# EAGLE design Control Board v0.2 (EAGLE 7.7.0)
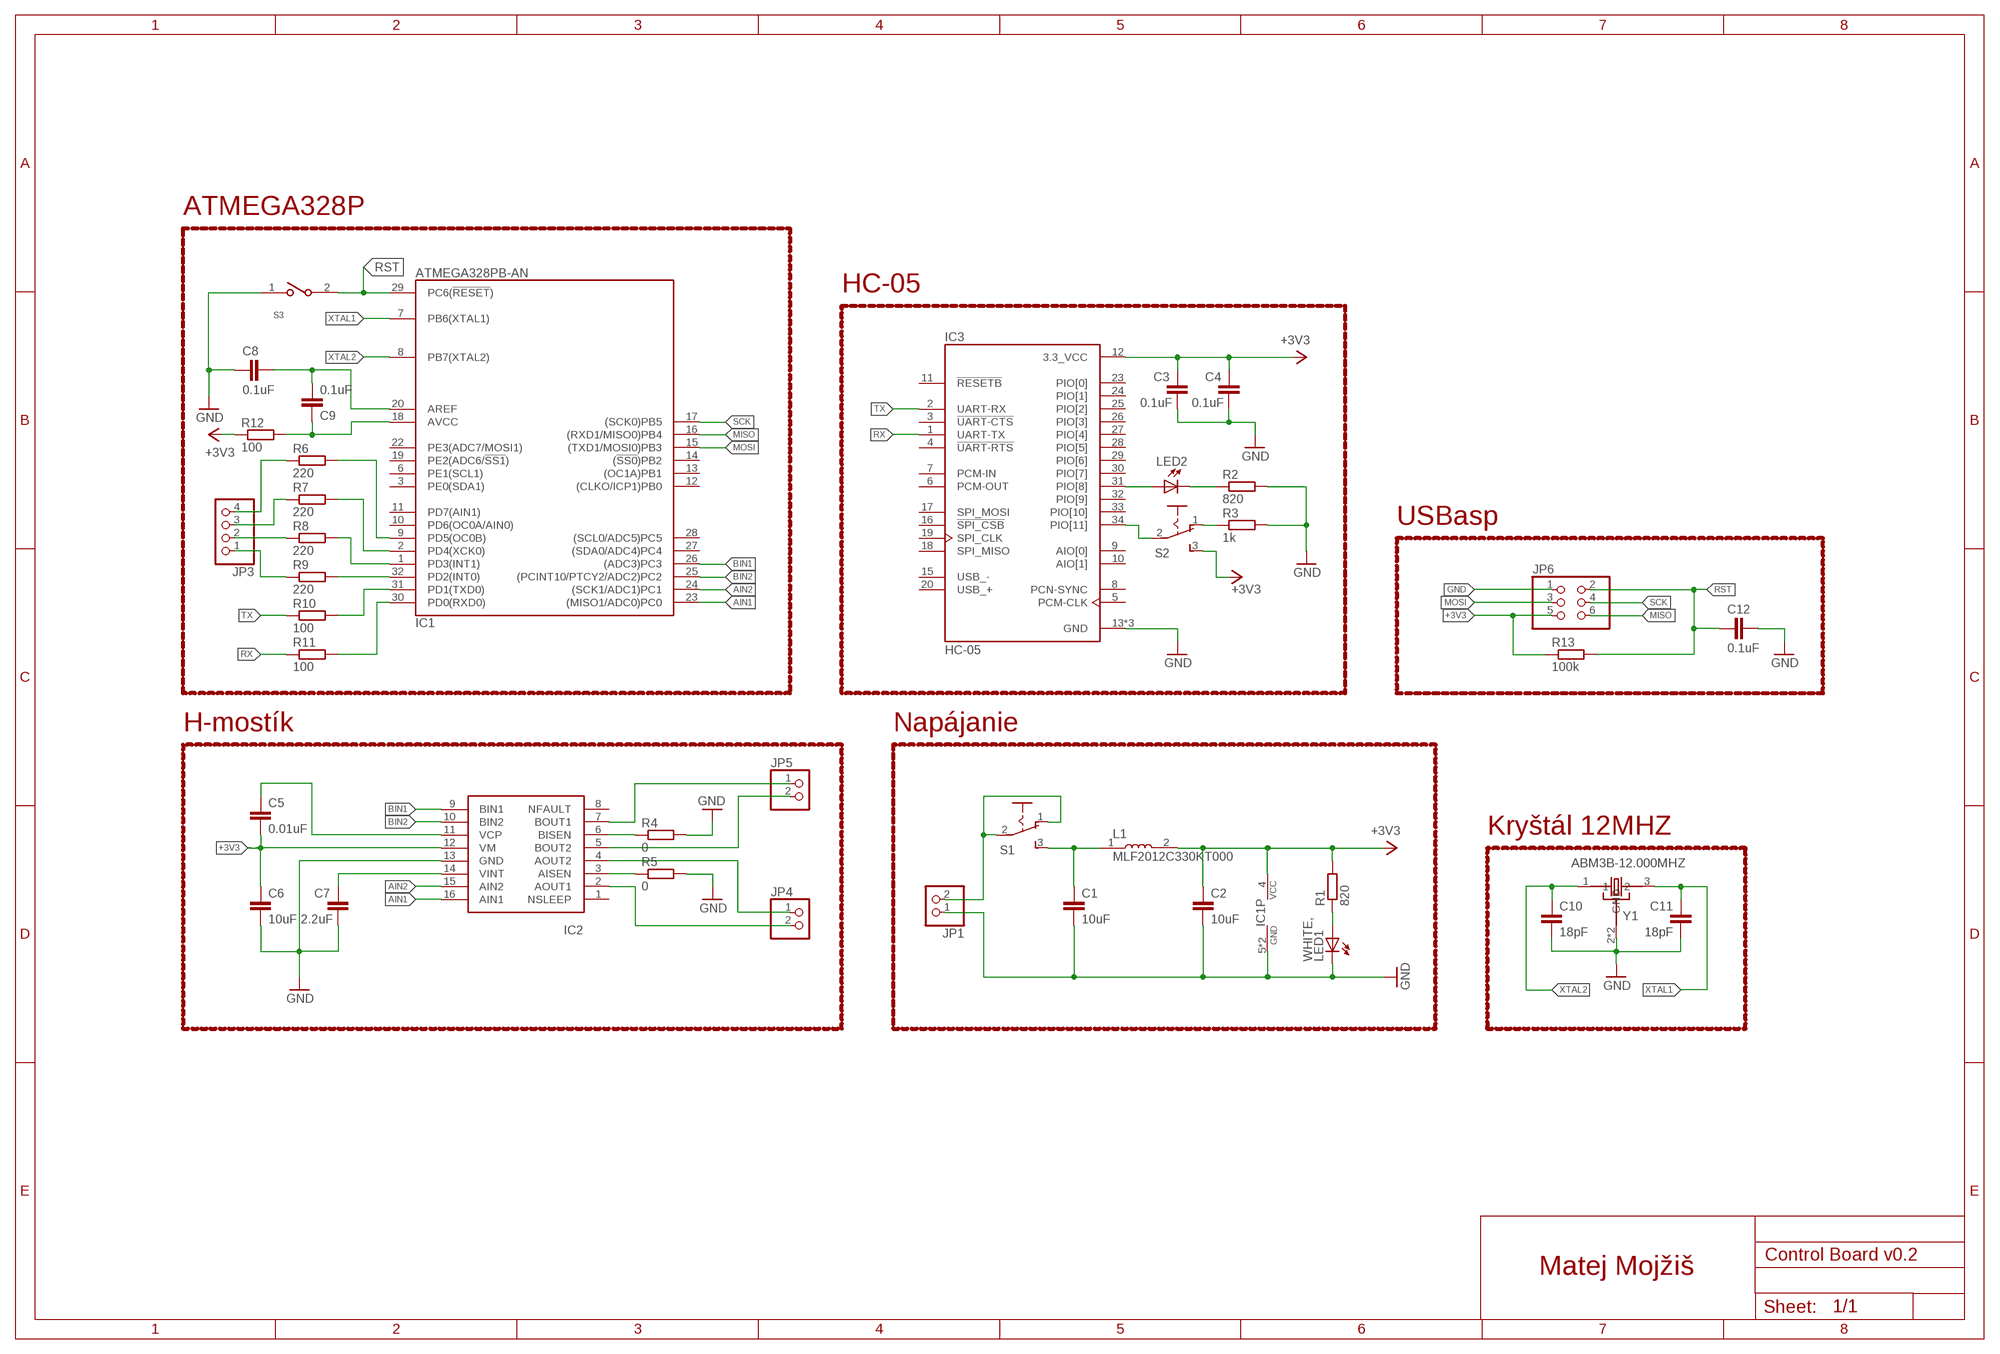
[diagram p0: schematic, sheet 1]

## Parts
C1  10uF  C-EUC0805  [C0805]
C2  10uF  C-EUC0805  [C0805]
C3  0.1uF  C-EUC0805  [C0805]
C4  0.1uF  C-EUC0805  [C0805]
C5  0.01uF  C-EUC0805  [C0805]
C6  10uF  C-EUC0805  [C0805]
C7  2.2uF  C-EUC0805  [C0805]
C8  0.1uF  C-EUC0805  [C0805]
C9  0.1uF  C-EUC0805  [C0805]
C10  18pF  C-EUC0805  [C0805]
C11  18pF  C-EUC0805  [C0805]
C12  0.1uF  C-EUC0805  [C0805]
IC1  ATMEGA328PB-AN  [QFP32_7X7_0.80]
IC2  DVR8833SUPERFICIAL  [PWP16]
IC3  HC-05  [XCVR_HC-05]
JP1  PINHD-1X2/90  [1X02/90]
JP3  PINHD-1X4  [1X04]
JP4  PINHD-1X2/90  [1X02/90]
JP5  PINHD-1X2/90  [1X02/90]
JP6  PINHD-2X3  [2X03]
L1  MLF2012C330KT000  [INDC2012X87N]
LED1  WHITE,  LEDCHIPLED_0805  [CHIPLED_0805]
LED2  RED  LEDCHIPLED_0805  [CHIPLED_0805]
R1  820  R-EU_R0805  [R0805]
R2  820  R-EU_R0805  [R0805]
R3  1k  R-EU_R0805  [R0805]
R4  0  R-EU_R0805  [R0805]
R5  0  R-EU_R0805  [R0805]
R6  220  R-EU_R0805  [R0805]
R7  220  R-EU_R0805  [R0805]
R8  220  R-EU_R0805  [R0805]
R9  220  R-EU_R0805  [R0805]
R10  100  R-EU_R0805  [R0805]
R11  100  R-EU_R0805  [R0805]
R12  100  R-EU_R0805  [R0805]
R13  100k  R-EU_R0805  [R0805]
S1  255SB  [255SB]
S2  255SB  [255SB]
S3  147873-2  [SW_147873-2]
Y1  ABM3B-12.000MHZ  ABM3B-8.000MHZ-B2-T  [OSCSC500X320X110-4N]

## Nets
3V7: C1.1 L1.1 S1.3(S)
+3V3: C2.1 C3.1 C4.1 C5.2 C6.1 IC1.4(VCC) IC2.12(VM) IC3.12(3.3_VCC) JP6.5 L1.2 R1.2 R12.1 R13.1 S2.3(S)
+3V7: JP1.2 S1.1(O) S1.2(P)
AIN1: IC1.23((MISO1/ADC0)PC0) IC2.16(AIN1)
AIN2: IC1.24((SCK1/ADC1)PC1) IC2.15(AIN2)
AISEN: IC2.3(AISEN) R5.1
AOUT1: IC2.2(AOUT1) JP4.2
AOUT2: IC2.4(AOUT2) JP4.1
AREF: C8.1 C9.2 IC1.20(AREF)
AVCC: C9.1 IC1.18(AVCC) R12.2
BACK: JP3.2 R8.1
BIN1: IC1.26((ADC3)PC3) IC2.9(BIN1)
BIN2: IC1.25((PCINT10/PTCY2/ADC2)PC2) IC2.10(BIN2)
BISEN: IC2.6(BISEN) R4.1
BOUT1: IC2.7(BOUT1) JP5.1
BOUT2: IC2.5(BOUT2) JP5.2
FRONT: JP3.1 R9.1
GND: C1.2 C2.2 C3.2 C4.2 C6.2 C7.2 C8.2 C10.2 C11.2 C12.1 IC1.5(GND) IC1.21(GND) IC2.13(GND) IC3.13(GND) IC3.21(GND) IC3.22(GND) JP1.1 JP6.1 LED1.C R2.2 R3.2 R4.2 R5.2 S3.1 Y1.2(GND) Y1.4(GND)
IN: LED1.A R1.1
INRX: IC1.30(PD0(RXD0)) R11.2
LED: LED2.C R2.1
LEFT: JP3.3 R7.1
MISO: IC1.16((RXD1/MISO0)PB4) JP6.6
MOSI: IC1.15((TXD1/MOSI0)PB3) JP6.3
OUTTX: IC1.31(PD1(TXD0)) R10.2
PD2: IC1.32(PD2(INT0)) R9.2
PD3: IC1.1(PD3(INT1)) R8.2
PD4: IC1.2(PD4(XCK0)) R7.2
PD5: IC1.9(PD5(OC0B)) R6.2
PIO8: IC3.31(PIO[8]) LED2.A
PIO11: IC3.34(PIO[11]) S2.2(P)
RIGHT: JP3.4 R6.1
RST: C12.2 IC1.29(PC6(!RESET!)) JP6.2 R13.2 S3.2
RX: IC3.1(UART-TX) R11.1
S: R3.1 S2.1(O)
SCK: IC1.17((SCK0)PB5) JP6.4
TX: IC3.2(UART-RX) R10.1
VCP: C5.1 IC2.11(VCP)
VINT: C7.1 IC2.14(VINT)
XTAL1: C11.1 IC1.7(PB6(XTAL1)) Y1.3
XTAL2: C10.1 IC1.8(PB7(XTAL2)) Y1.1
Unconnected: IC1.3(PE0(SDA1)) IC1.6(PE1(SCL1)) IC1.10(PD6(OC0A/AIN0)) IC1.11(PD7(AIN1)) IC1.12((CLKO/ICP1)PB0) IC1.13((OC1A)PB1) IC1.14((!SS0!)PB2) IC1.19(PE2(ADC6/!SS1!)) IC1.22(PE3(ADC7/MOSI1)) IC1.27((SDA0/ADC4)PC4) IC1.28((SCL0/ADC5)PC5) IC2.1(NSLEEP) IC2.8(NFAULT) IC3.3(!UART-CTS) IC3.4(!UART-RTS) IC3.5(PCM-CLK) IC3.6(PCM-OUT) IC3.7(PCM-IN) IC3.8(PCN-SYNC) IC3.9(AIO[0]) IC3.10(AIO[1]) IC3.11(!RESETB) IC3.15(USB_-) IC3.16(!SPI_CSB) IC3.17(SPI_MOSI) IC3.18(SPI_MISO) IC3.19(SPI_CLK) IC3.20(USB_+) IC3.23(PIO[0]) IC3.24(PIO[1]) IC3.25(PIO[2]) IC3.26(PIO[3]) IC3.27(PIO[4]) IC3.28(PIO[5]) IC3.29(PIO[6]) IC3.30(PIO[7]) IC3.32(PIO[9]) IC3.33(PIO[10])

## Notes on the sheet
- ATMEGA328P
- HC-05
- USBasp
- H-mostík | Napájanie
- Kryštál 12MHZ
- Matej Mojžiš

## Library data of the parts
C1-C12 = rcl:C-EU: CAPACITOR, European symbol
IC1 = atmel328new:ATMEGA328PB: 8-bit AVR Microcontroller 32kbytes flash 2kbytes SRAM 1kbyte EEPROM USART 8-channel 10 bit ADC
IC2 = personales:DVR8833
IC3 = HC-05:HC-05: Bluetooth to Serial Port Module; AVAILABILITY: Unavailable; DESCRIPTION: Bluetooth to Serial Port Module; MF: Bel Power solution; MP: HC-05; PACKAGE: SOIC-14; PRICE: None
JP1 JP4 JP5 = pinhead:PINHD-1X2: PIN HEADER
JP3 = pinhead:PINHD-1X4: PIN HEADER
JP6 = pinhead:PINHD-2X3: PIN HEADER
L1 = MLF2012C330KT000:MLF2012C330KT000: FIXED IND 33UH 5MA 1.1 OHM SMD Check prices <https://pricing.snapeda.com/parts/MLF2012C330KT000/TDK/view-part?ref=eda>; AVAILABILITY: Warning; DESCRIPTION: Fixed Ind 33uh 5ma 1.1 Ohm Smd; MF: TDK; MP: MLF2012C330KT000; PACKAGE: 0805 TDK; PRICE: None; PURCHASE-URL: https://pricing.snapeda.com/search/part/MLF2012C330KT000/?ref=eda
LED1 LED2 = led:LED: LED OSRAM: - CHIPLED LG R971, LG N971, LY N971, LG Q971, LY Q971, LO R971, LY R971 LH N974, LH R974 LS Q976, LO Q976, LY Q976 LO Q996 - Hyper CHIPLED LW Q18S LB Q993, LB Q99A, LB R99A - SideLED LS A670, LO A670, LY A670, LG A670, LP A670 LB A673, LV A673, LT A673, LW A673 LH A674 LY A675 LS A676, LA A676, LO A676, LY A676, LW A676 LS A679, LY A679, LG A679 - Hyper Micro SIDELED® LS Y876, LA Y876, LO Y876, LY Y876 LT Y87S - SmartLED LW L88C, LW L88S LB L89C, LB L89S, LG L890 LS L89K, LO L89K, LY L89K LS L896, LA L896, LO L896, LY L896 - TOPLED LS T670, LO T670, LY T670, LG T670, LP T670 LSG T670, LSP T670, LSY T670, LOP T670, LYG T670 LG T671, LOG T671, LSG T671 LB T673, LV T673, LT T673, LW T673 LH T674 LS T676, LA T676, LO T676, LY T676, LB T676, LH T676, LSB T676, LW T676 LB T67C, LV T67C, LT T67C, LS T67K, LO T67K, LY T67K, LW E67C LS E67B, LA E67B, LO E67B, LY E67B, LB E67C, LV E67C, LT E67C LW T67C LS T679, LY T679, LG T679 LS T770, LO T770, LY T770, LG T770, LP T770 LB T773, LV T773, LT T773, LW T773 LH T774 LS E675, LA E675, LY E675, LS T675 LS T776, LA T776, LO T776, LY T776, LB T776 LHGB T686 LT T68C, LB T68C - Hyper Mini TOPLED® LB M676 - Mini TOPLED Santana® LG M470 LS M47K, LO M47K, LY M47K Source: http://www.osram.convergy.de LUXEON: - LUMILED® LXK2-PW12-R00, LXK2-PW12-S00, LXK2-PW14-U00, LXK2-PW14-V00 LXK2-PM12-R00, LXK2-PM12-S00, LXK2-PM14-U00 LXK2-PE12-Q00, LXK2-PE12-R00, LXK2-PE12-S00, LXK2-PE14-T00, LXK2-PE14-U00 LXK2-PB12-K00, LXK2-PB12-L00, LXK2-PB12-M00, LXK2-PB14-N00, LXK2-PB14-P00, LXK2-PB14-Q00 LXK2-PR12-L00, LXK2-PR12-M00, LXK2-PR14-Q00, LXK2-PR14-R00 LXK2-PD12-Q00, LXK2-PD12-R00, LXK2-PD12-S00 LXK2-PH12-R00, LXK2-PH12-S00 LXK2-PL12-P00, LXK2-PL12-Q00, LXK2-PL12-R00 Source: www.luxeon.com KINGBRIGHT: KA-3528ASYC Source: www.kingbright.com
R1-R13 = rcl:R-EU_: RESISTOR, European symbol
S1 S2 = switch:255SB: SLIDING SWITCH Distributor Buerklin, 11G810
S3 = 147873-2:147873-2: SWITCH TACTILE SPST-NO 0.05A 24V Check prices <https://pricing.snapeda.com/parts/147873-2/TE%20Connectivity/view-part?ref=eda>; AVAILABILITY: Good; COMMENT: 147873-2; CONFIGURATION_POLE-THROW: Single Pole - Single Throw; CONTACT_CURRENT_RATING: 50 mA; DESCRIPTION: Switch Tactile OFF (ON) SPST Rectangular Button J-Bend 0.05A 24VDC 1.77N SMD T/R; MF: TE Connectivity; MP: 147873-2; PACKAGE: None; PRICE: None; PURCHASE-URL: https://pricing.snapeda.com/search/part/147873-2/?ref=eda
Y1 = ABM3B-8.000MHZ-B2-T:ABM3B-8.000MHZ-B2-T: Crystal 8MHz ±20ppm (Tol) ±50ppm (Stability) 18pF FUND 200Ohm 4-Pin CSMD T/R Check prices <https://pricing.snapeda.com/parts/ABM3B-8.000MHZ-B2-T/Abracon/view-part?ref=eda>; AVAILABILITY: Good; DESCRIPTION: 8MHz ±20ppm Crystal 18pF 200 Ohms 4-SMD, No Lead; MF: Abracon; MP: ABM3B-8.000MHZ-B2-T; PACKAGE: SMD-4 Abracon; PRICE: None; PURCHASE-URL: https://pricing.snapeda.com/search/part/ABM3B-8.000MHZ-B2-T/?ref=eda

## Board
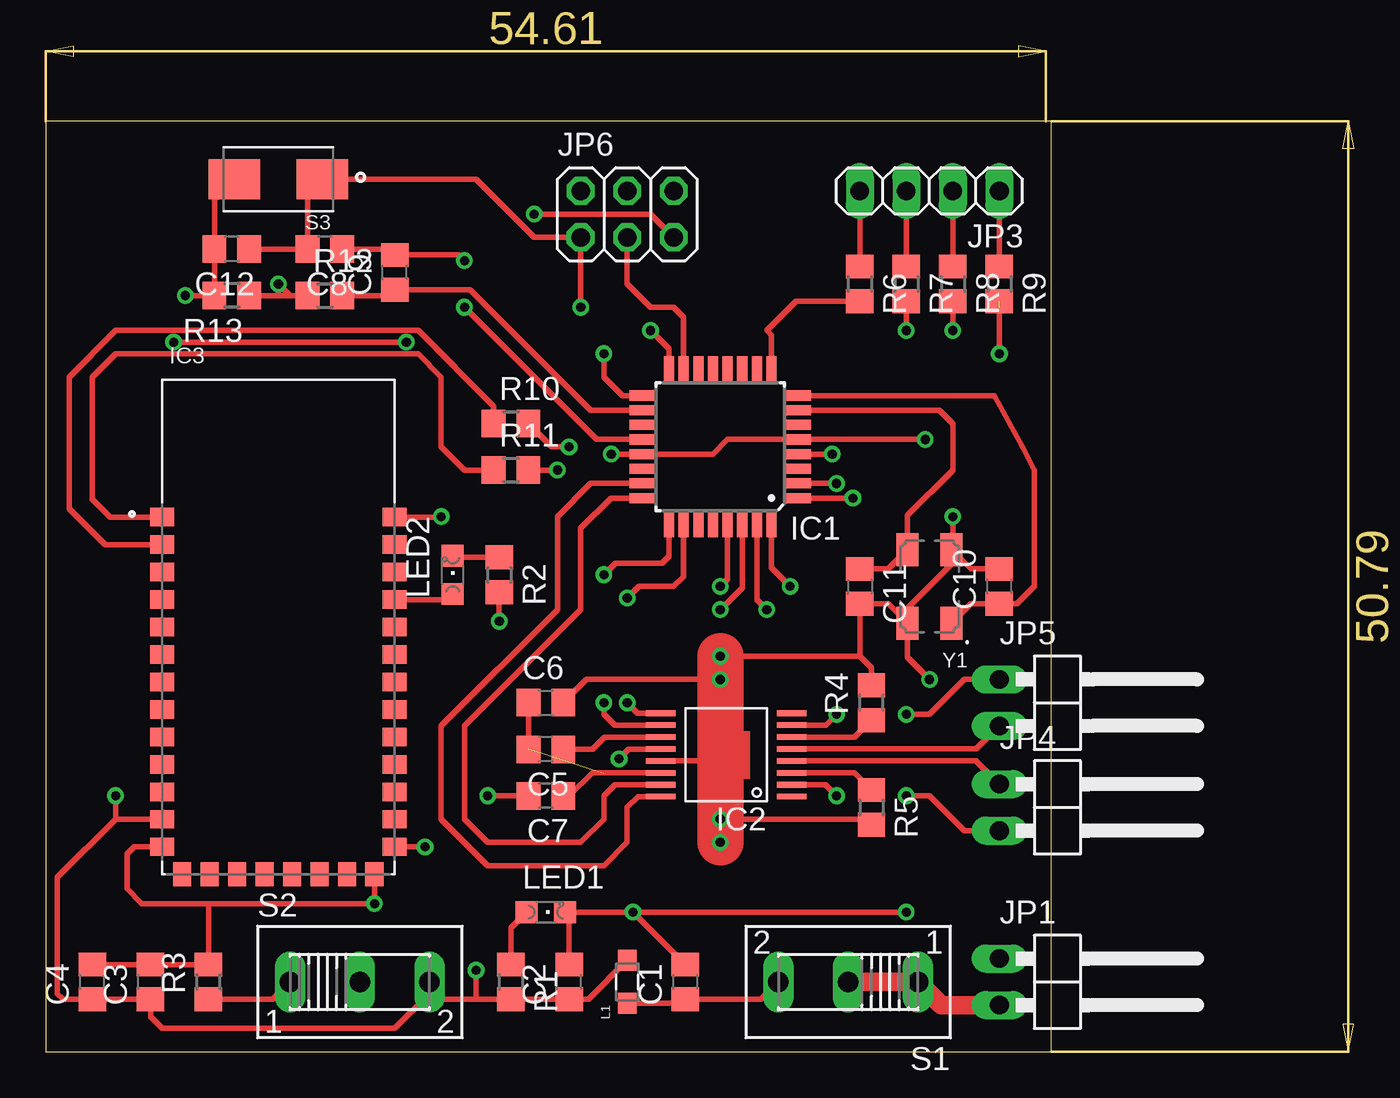
[diagram p1: board, top side]
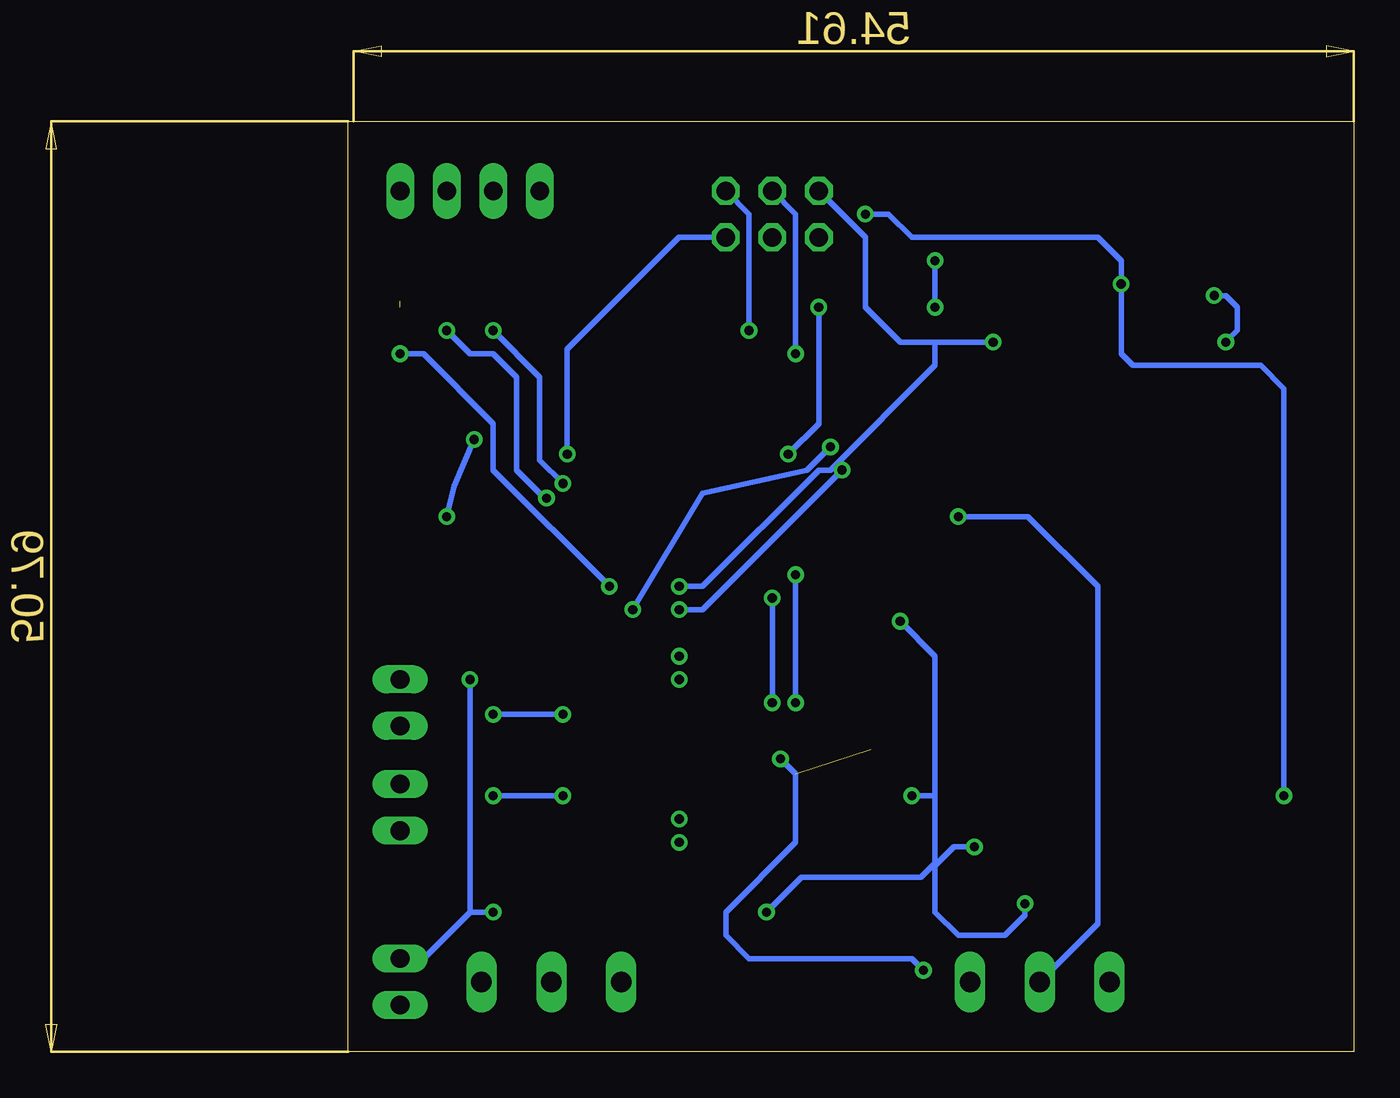
[diagram p2: board, bottom side, seen from below]

Size 54.91 x 50.79 mm. Coordinates in mm from the lower left corner, seen from the top.
Outline: 0,0 54.91,0 54.91,50.79 0,50.79 0,0
Copper layers (1*16): Top 0.035mm / dielectric 1.5mm / Bottom 0.035mm
Design rules "default": minimum track width 10mil, minimum drill 24mil, track to track 8mil, track to pad 8mil, pad to pad 8mil, via to via 8mil, smd to smd 8mil, copper to edge 40mil, drill to drill 8mil, minimum pad ring 10mil, minimum via ring 8mil, stop-mask expansion 4mil, vias tented up to drill 0mil, thermal gap 10mil

### Footprints (pad centres in the part's own frame; a part is rotated, then mirrored left to right if it is on the bottom)
C0805 = smd 1.3 x 1.5: 1 -0.95,0; 2 0.95,0
QFP32_7X7_0.80 = smd 1.5 x 0.55: 1 -4.2,2.8; 2 -4.2,2; 3 -4.2,1.2; 4 -4.2,0.4; 5 -4.2,-0.4; 6 -4.2,-1.2; 7 -4.2,-2; 8 -4.2,-2.8; 17 4.2,-2.8; 18 4.2,-2; 19 4.2,-1.2; 20 4.2,-0.4; 21 4.2,0.4; 22 4.2,1.2; 23 4.2,2; 24 4.2,2.8 | smd 0.55 x 1.5: 9 -2.8,-4.2; 10 -2,-4.2; 11 -1.2,-4.2; 12 -0.4,-4.2; 13 0.4,-4.2; 14 1.2,-4.2; 15 2,-4.2; 16 2.8,-4.2; 25 2.8,4.2; 26 2,4.2; 27 1.2,4.2; 28 0.4,4.2; 29 -0.4,4.2; 30 -1.2,4.2; 31 -2,4.2; 32 -2.8,4.2
PWP16 = smd 0.305 x 1.6: 1 -1.95,-3.9; 2 -1.3,-3.9; 3 -0.65,-3.9; 4 0,-3.9; 5 0.65,-3.9; 6 1.3,-3.9; 7 1.95,-3.9; 8 2.6,-3.9; 9 2.6,3.25; 10 1.95,3.25; 11 1.3,3.25; 12 0.65,3.25; 13 0,3.25; 14 -0.65,3.25; 15 -1.3,3.25; 16 -1.95,3.25
XCVR_HC-05 = smd 1.3 x 1: 1 -6.35,6.325; 2 -6.35,4.825; 3 -6.35,3.325; 4 -6.35,1.825; 5 -6.35,0.325; 6 -6.35,-1.175; 7 -6.35,-2.675; 8 -6.35,-4.175; 9 -6.35,-5.675; 10 -6.35,-7.175; 11 -6.35,-8.675; 12 -6.35,-10.175; 13 -6.35,-11.675; 22 6.35,-11.675; 23 6.35,-10.175; 24 6.35,-8.675; 25 6.35,-7.175; 26 6.35,-5.675; 27 6.35,-4.175; 28 6.35,-2.675; 29 6.35,-1.175; 30 6.35,0.325; 31 6.35,1.825; 32 6.35,3.325; 33 6.35,4.825; 34 6.35,6.325 | smd 1 x 1.3: 14 -5.25,-13.175; 15 -3.75,-13.175; 16 -2.25,-13.175; 17 -0.75,-13.175; 18 0.75,-13.175; 19 2.25,-13.175; 20 3.75,-13.175; 21 5.25,-13.175
1X02/90 = drill 1.016 long: 1 -1.27,-3.81; 2 1.27,-3.81
1X04 = drill 1.016 long: 1 -3.81,0; 2 -1.27,0; 3 1.27,0; 4 3.81,0
2X03 = drill 1.016 octagon: 1 -2.54,-1.27; 2 -2.54,1.27; 3 0,-1.27; 4 0,1.27; 5 2.54,-1.27; 6 2.54,1.27
INDC2012X87N = smd 1.15 x 1: 1 -1.175,0; 2 1.175,0
CHIPLED_0805 = smd 1.2 x 1.2: A 0,-1.05; C 0,1.05
R0805 = smd 1.3 x 1.5: 1 -0.95,0; 2 0.95,0
255SB = drill 1.118 long: 1 -3.81,0; 2 0,0; 3 3.81,0
SW_147873-2 = smd 2.8 x 2.2: 1 -2.4,0; 2 2.4,0
OSCSC500X320X110-4N = smd 1.2 x 1.8: 1 -1.2,2; 2 -1.2,-2; 3 1.2,-2; 4 1.2,2

### Placement (x,y rotation side)
C1  34.92,3.81 90 top
C2  28.57,3.81 90 top
C3  5.71,3.81 90 top
C4  2.54,3.81 90 top
C5  27.3,16.51 180 top
C6  27.3,19.05 0 top
C7  27.3,13.97 180 top
C8  15.24,43.81 180 top
C9  19.05,42.55 90 top
C10  52.07,25.4 90 top
C11  44.45,25.4 270 top
C12  10.16,43.81 180 top
IC1  36.83,33.02 180 top
IC2  36.83,15.88 90 top
IC3  12.7,22.86 0 top
JP1  55.88,3.81 270 top
JP3  48.26,46.99 180 top
JP4  55.88,13.34 270 top
JP5  55.88,19.05 270 top
JP6  31.75,45.72 0 top
L1  31.75,3.81 90 top
LED1  27.3,7.62 270 top
LED2  22.23,26.04 0 top
R1  25.4,3.81 270 top
R2  24.77,26.04 270 top
R3  8.89,3.81 90 top
R4  45.09,19.05 90 top
R5  45.09,13.34 270 top
R6  44.45,41.91 270 top
R7  46.99,41.91 270 top
R8  49.53,41.91 270 top
R9  52.07,41.91 270 top
R10  25.4,34.29 0 top
R11  25.4,31.75 0 top
R12  15.24,41.27 0 top
R13  10.16,41.27 180 top
S1  43.81,3.81 180 top
S2  17.14,3.81 0 top
S3  12.7,47.62 180 top
Y1  48.26,25.4 180 top

### Tracks (layer width: path | path; a pad name or v marks a point on that pad's centre or on a via)
3V7
  Top 0.305: S1.3 39.05,2.86 C1.1 34.06,2.63 L1.1
+3V3  (via drill 0.5 pad 0.3)  (1 unrouted)
  Top 0.305: C6.1 C5.2 | L1.2 29.63,2.86 C2.1 R1.2 23.5,2.86 | C4.1 2.52,2.85 | C4.1 C3.1 5.71,1.91 6.35,1.27 19.05,1.27 20.96,3.17 | IC2.12 33.56,16.51 31.82,16.51 v31.3,15.99 | 12.7,41.27 R12.1 13.33,41.27 v12.7,41.91 12.7,41.27 | 12.7,41.27 R13.1 | 23.5,2.86 21.27,2.86 20.96,3.17 | IC3.12 6.33,12.7 3.81,12.7 | 3.81,12.7 0.64,9.53 0.64,3.17 0.95,2.86 C4.1 | 20.96,3.17 S2.3 | IC1.4 v42.95,32.62 | v26.67,45.72 33.02,45.72 JP6.5 | v23.5,4.45 23.5,2.86 | v3.81,13.97 3.81,12.7
  Bottom 0.305: JP6.5 36.83,44.45 42.95,38.34 v42.95,32.62 | v26.67,45.72 25.4,45.72 24.13,44.45 13.97,44.45 12.7,43.18 v12.7,41.91 12.7,38.1 12.06,37.47 5.08,37.47 3.81,36.2 v3.81,13.97 | v31.3,15.99 30.48,15.17 30.48,11.43 34.29,7.62 34.29,6.35 33.02,5.08 24.13,5.08 v23.5,4.45
+3V7
  Top 1.016: S1.2 S1.1 48.89,2.54 JP1.2
AIN1
  Top 0.305: IC2.16 32.34,13.93 31.75,13.34 31.75,11.43 30.48,10.16 24.13,10.16 21.59,12.7 21.59,17.78 27.94,24.13 27.94,29.21 29.75,31.02 IC1.23
AIN2
  Top 0.305: IC2.15 31.09,14.57 30.48,13.97 30.48,12.7 29.21,11.43 24.13,11.43 22.86,12.7 22.86,17.78 29.21,24.13 29.21,25.4 29.21,26.67 29.21,28.57 30.86,30.22 IC1.24
AISEN
  Top 0.305: IC2.3 44.14,15.22 R5.1
AOUT1  (via drill 0.5 pad 0.3)
  Top 0.305: JP4.2 50.16,12.06 48.26,13.97 v46.99,13.97 | IC2.2 42.57,14.57 v43.18,13.97
  Bottom 0.305: v43.18,13.97 v46.99,13.97
AOUT2
  Top 0.305: IC2.4 50.8,15.88 JP4.1
AREF  (via drill 0.5 pad 0.3)
  Top 0.305: IC1.20 30.08,33.42 v22.86,40.64 | C8.1 18.73,43.81 C9.2 22.55,43.49 v22.86,43.18
  Bottom 0.305: v22.86,40.64 v22.86,43.18
AVCC
  Top 0.305: IC1.18 29.75,35.02 23.18,41.59 C9.1 18.73,41.27 R12.2
BACK
  Top 0.305: JP3.2 R8.1
BIN1  (via drill 0.5 pad 0.3)
  Top 0.305: IC2.9 32.32,18.48 v31.75,19.05 | IC1.26 34.83,25.94 34.29,25.4 32.38,25.4 v31.75,24.77
  Bottom 0.305: v31.75,19.05 v31.75,24.77
BIN2  (via drill 0.5 pad 0.3)
  Top 0.305: IC2.10 31.07,17.82 30.48,18.41 v30.48,19.05 | IC1.25 34.03,27.05 33.66,26.67 31.11,26.67 v30.48,26.04
  Bottom 0.305: v30.48,19.05 30.48,22.86 30.48,24.13 v30.48,26.04
BISEN
  Top 0.305: IC2.6 44.16,17.18 R4.1
BOUT1  (via drill 0.5 pad 0.41)
  Top 0.305: JP5.1 50.16,20.32 48.26,18.41 v46.99,18.41 | IC2.7 42.59,17.82 v43.18,18.41
  Bottom 0.305: v43.18,18.41 v46.99,18.41
BOUT2
  Top 0.305: IC2.5 50.81,16.52 JP5.2
FRONT
  Top 0.305: R9.1 JP3.1
GND  (via drill 0.5 pad 0.3)
  Top 0.305: C7.2 v24.13,13.97 | Y1.4 46.01,24.45 C11.2 44.45,21.59 | Y1.4 47.06,24.2 49.46,26.6 49.46,26.67 | 49.46,26.67 Y1.2 50.51,26.35 C10.2 | 19.05,10.79 IC3.22 v20.71,11.19 | IC2.13 36.83,15.88 | 2.23,4.45 C4.2 C3.2 R3.2 8.89,8.09 | C2.2 28.57,7.4 LED1.C v32.06,7.62 | IC3.21 v17.95,8.09 8.89,8.09 | R4.2 45.09,20.95 44.45,21.59 | 44.45,21.59 v36.83,21.59 | C6.2 29.53,20.32 v36.83,20.32 | R2.2 v24.77,23.5 | 8.89,8.09 5.25,8.09 4.45,8.89 4.45,10.79 4.83,11.19 IC3.13 | C12.1 C8.2 14.29,46.81 S3.1 23.5,47.62 26.67,44.45 JP6.1 v29.21,40.64 | v48.26,20.32 47.06,21.52 Y1.4 | R5.2 44.77,12.7 v36.83,12.7 | v48.02,33.42 IC1.5 37.23,33.42 36.43,32.62 IC1.21 v30.88,32.62 | v49.53,29.21 49.53,26.74 49.46,26.67 | v32.06,7.62 v46.99,7.62 | C1.2 v32.06,7.62
  Top 2.54: v36.83,11.43 v36.83,12.7 36.83,15.88 v36.83,20.32 v36.83,21.59
  Bottom 0.305: v17.95,8.09 17.95,7.45 19.05,6.35 21.59,6.35 22.86,7.62 22.86,10.16 | v20.71,11.19 21.84,11.19 22.86,10.16 | 22.86,13.97 v24.13,13.97 | JP1.1 50.8,5.08 48.26,7.62 | 22.86,10.29 22.86,13.97 | v24.77,23.5 22.86,21.59 22.86,13.97 | v32.06,7.62 30.16,9.53 23.63,9.53 22.86,10.29 | 22.86,10.29 22.86,10.16 | 48.26,7.62 v48.26,20.32 | v48.02,33.42 49.13,30.88 v49.53,29.21 | v30.88,32.62 29.21,34.29 v29.21,40.64 | v46.99,7.62 48.26,7.62
IN
  Top 0.305: LED1.A 25.4,6.76 R1.1
INRX  (via drill 0.5 pad 0.3)
  Top 0.305: R11.2 v27.94,31.75 | IC1.30 38.03,25.33 v36.83,24.13
  Bottom 0.305: v27.94,31.75 35.56,24.13 v36.83,24.13
LED
  Top 0.305: LED2.C 22.33,26.98 R2.1
LEFT
  Top 0.305: R7.1 JP3.3
MISO  (via drill 0.5 pad 0.3)
  Top 0.305: v33.02,39.37 34.03,38.36 IC1.16
  Bottom 0.305: JP6.6 33.02,45.72 v33.02,39.37
MOSI
  Top 0.305: IC1.15 34.83,40.1 34.29,40.64 33.02,40.64 31.75,41.91 JP6.3
OUTTX  (via drill 0.5 pad 0.3)
  Top 0.305: IC1.31 38.83,24.67 v39.37,24.13 | R10.2 27.62,33.02 v28.57,33.02
  Bottom 0.305: v28.57,33.02 29.85,31.75 35.56,30.48 v39.37,24.13
PD2  (via drill 0.5 pad 0.3)  (1 unrouted)
  Top 0.305: IC1.32 39.63,26.41 v40.64,25.4 | v52.07,38.1 52.07,40.64
  Bottom 0.305: v40.64,25.4 46.99,31.75 46.99,34.29 50.8,38.1 v52.07,38.1
PD3  (via drill 0.5 pad 0.3)
  Top 0.305: IC1.1 v44.07,30.22 | v49.53,39.37 R8.2
  Bottom 0.305: v44.07,30.22 44.19,30.22 45.72,31.75 45.72,36.83 46.99,38.1 48.26,38.1 v49.53,39.37
PD4  (via drill 0.5 pad 0.3)
  Top 0.305: R7.2 v46.99,39.37 | v43.18,31.02 IC1.2
  Bottom 0.305: v46.99,39.37 44.45,36.83 44.45,32.29 v43.18,31.02
PD5
  Top 0.305: IC1.9 39.63,39.11 39.37,39.37 40.96,40.96 R6.2
PIO8
  Top 0.305: 19.13,24.77 IC3.31 21.93,24.68 LED2.A
PIO11  (via drill 0.5 pad 0.3)
  Top 0.305: v21.59,29.21 21.57,29.18 IC3.34
  Bottom 0.305: v21.59,29.21 17.78,29.21 13.97,25.4 13.97,6.99 S2.2
RIGHT
  Top 0.305: JP3.4 R6.1
RST  (via drill 0.5 pad 0.3)
  Top 0.305: S3.2 9.21,46.53 C12.2 R13.2 v7.62,41.27 | IC1.29 37.23,25.8 v36.83,25.4 | v6.98,38.73 v19.69,38.73
  Bottom 0.305: v7.62,41.27 6.98,41.27 6.35,40.64 6.35,39.37 v6.98,38.73 | 22.86,38.73 24.77,38.73 26.67,40.64 26.67,44.45 JP6.2 | v36.83,25.4 35.56,25.4 29.21,31.75 28.57,31.75 22.86,37.47 22.86,38.73 | v19.69,38.73 22.86,38.73
RX
  Top 0.305: IC3.1 3.52,29.18 2.54,30.16 2.54,36.83 3.81,38.1 20.32,38.1 21.59,36.83 21.59,33.02 22.86,31.75 R11.1
S
  Top 0.305: R3.1 12.38,2.86 S2.1
SCK  (via drill 0.5 pad 0.3)
  Top 0.305: v30.48,38.1 30.48,36.83 31.49,35.82 IC1.17
  Bottom 0.305: JP6.4 30.48,45.72 v30.48,38.1
TX
  Top 0.305: IC3.2 3.23,27.68 1.27,29.65 1.27,36.83 3.81,39.37 20.32,39.37 24.45,35.24 R10.1
VCP
  Top 0.305: IC2.11 30.51,17.18 29.85,16.51 C5.1
VINT
  Top 0.305: C7.1 28.57,13.97 29.85,15.24 33.56,15.24 IC2.14
XTAL1
  Top 0.305: C11.1 46.01,26.35 Y1.3 47.06,29.28 49.53,31.75 49.53,34.29 48.8,35.02 IC1.7
XTAL2
  Top 0.305: Y1.1 50.51,24.45 C10.1 53.02,24.45 53.97,25.4 53.97,31.75 53.34,33.02 51.81,35.82 IC1.8